# Altium schematic sheet USB.SchDoc
size Letter; SheetNumber: 18; SheetTotal: 22
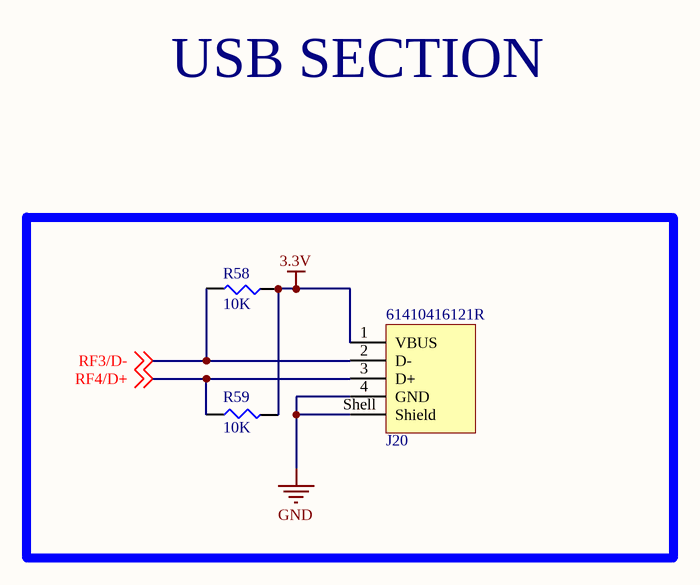
[diagram p0: USB.SchDoc]

## Parts
J20  61410416121R  [61410416121R]
R58  10K  [SMD-0805-RES]
R59  10K  [SMD-0805-RES]

## Nets
3.3V: J20.1(VBUS) R58.1 R59.2
GND: J20.4(GND) J20.Shell(Shield)
RF3/D-: J20.2(D-) R58.2 ; off-sheet RF3/D-
RF4/D+: J20.3(D+) R59.1 ; off-sheet RF4/D+

## Notes on the sheet
- USB SECTION

## Library data of the parts
J20 = 61410416121R: WR-COM USB 2.0 Type B Horizontal THR; Manufacturer: Wurth Elektronik; Match Code: WR-USB; Gender: Receptacle; Interface Type: Type B; Number of Ports: 1; Rated Current: 1.5A; Working Voltage: 30V (AC); Manufacturer Part Number: 61410416121R; Category: Input/Output Connectors; ComponentLink1Description: Website Link; ComponentLink1URL: https://www.we-online.com/redexpert/article/61410416121R?ad; ComponentLink2Description: Datasheet Link; ComponentLink2URL: https://www.we-online.com/redexpert/spec/61410416121R?ad; Mount: Surface Mount; Operating Temperature Max: 85°C; Operating Temperature Min: -55°C; Packaging: Tape and Reel; Application: USB 2.0; Number of Pins: 4; Orientation: Horizontal
R58 R59 = ERJ-6ENF1001V: RES SMD 1K OHM 1% 1/8W 0805; Manufacturer: Panasonic Electronic Components; Factory Stock: 0; Unit Price (USD): 0.00729; @ qty: 1500; Minimum Quantity: 1; Power (Watts): 0.125W, 1/8W; Temperature Coefficient: ±100ppm/°C; Part Number: ERJ-6ENF1001V; Datasheets: http://industrial.panasonic.com/www-cgi/jvcr13pz.cgi?E+PZ+3+AOA0002+ERJ6ENF1001V+7+WW; Image: //media.digikey.com/Renders/Panasonic%20Renders/ERJ-0805%20Pkg.jpg; Digi-Key Part Number: P1.00KCCT-ND; Quantity Available: 12895103; Packaging: Cut Tape (CT); Series: ERJ; Part Status: Active; Value: 1k; Tolerance: ±1%; Composition: Thick Film; Features: Automotive AEC-Q200; Operating Temperature: -55°C ~ 155°C; Package / Case: 0805 (2012 Metric); Supplier Device Package: 0805; Size / Dimension: 0.079" L x 0.049" W (2.00mm x 1.25mm); Height - Seated (Max): 0.028" (0.70mm); Number of Terminations: 2; Failure Rate: -